# EAGLE board PCB-E21-CMB6_v03-17 (EAGLE 7.7.0), part 1 of 2
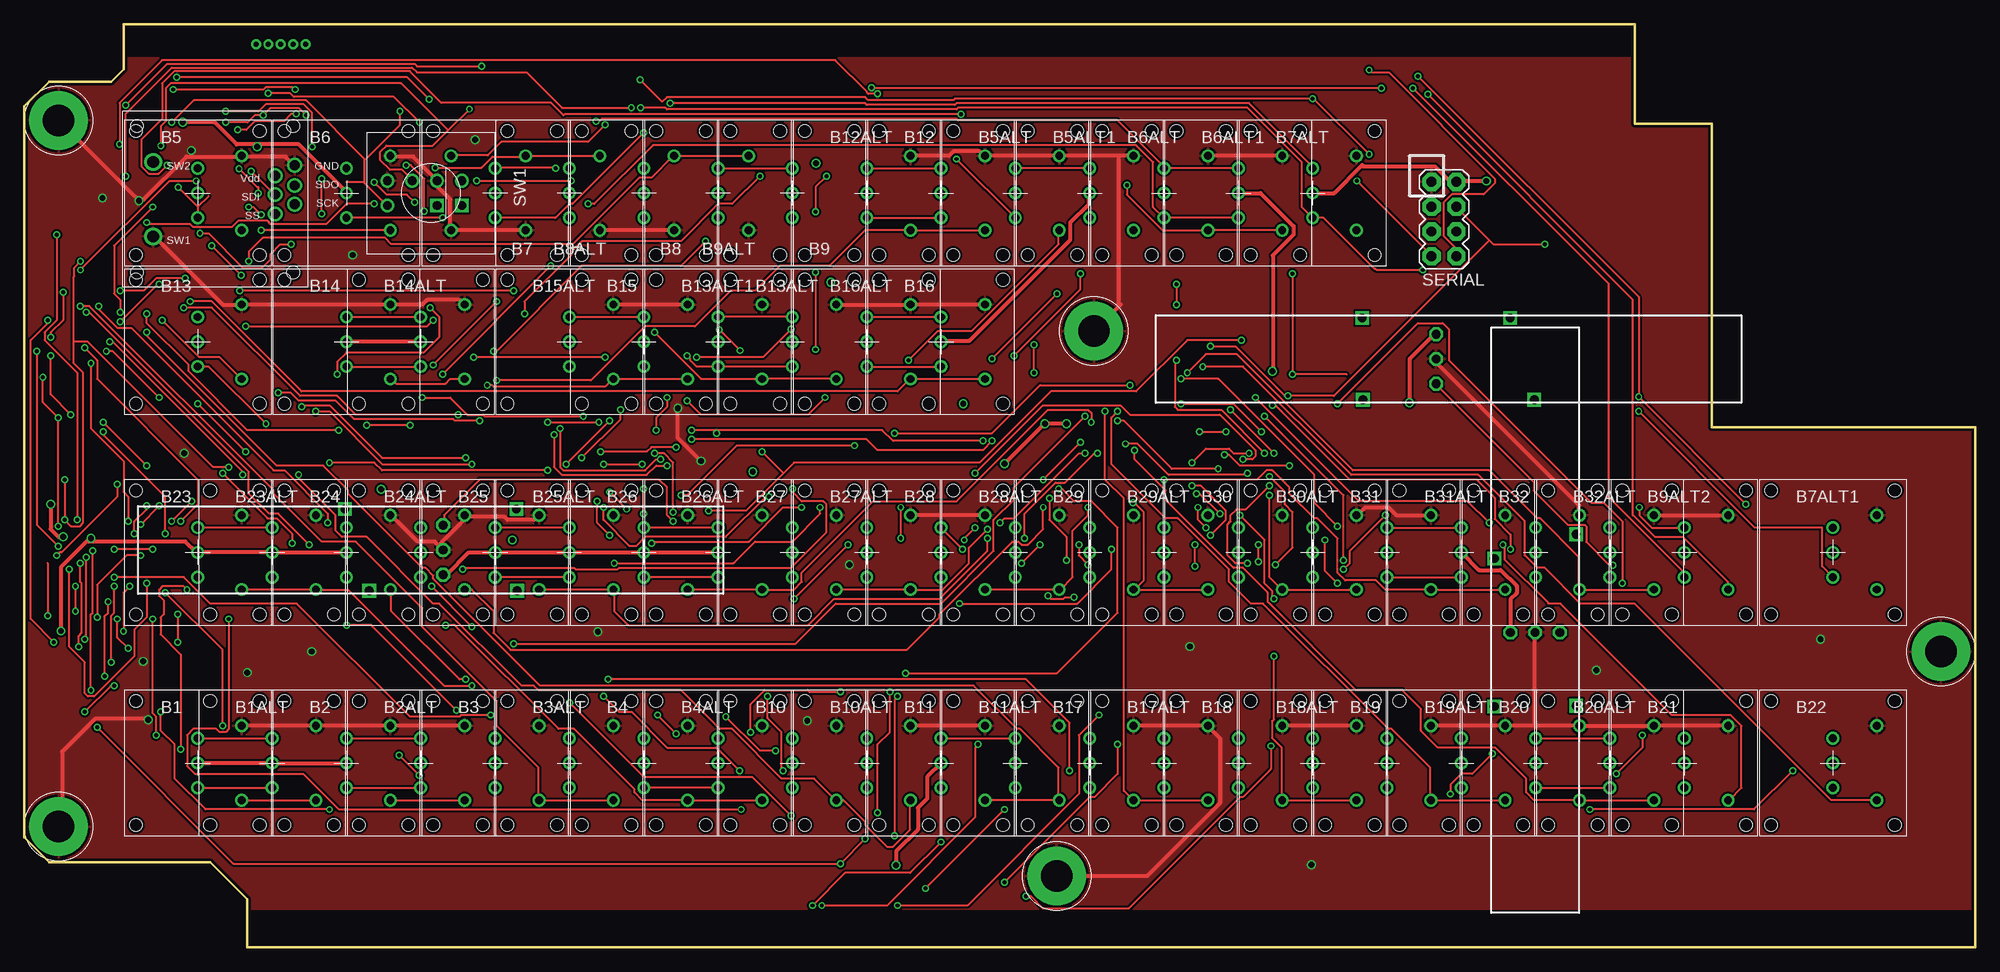
[diagram p6: board, top side]
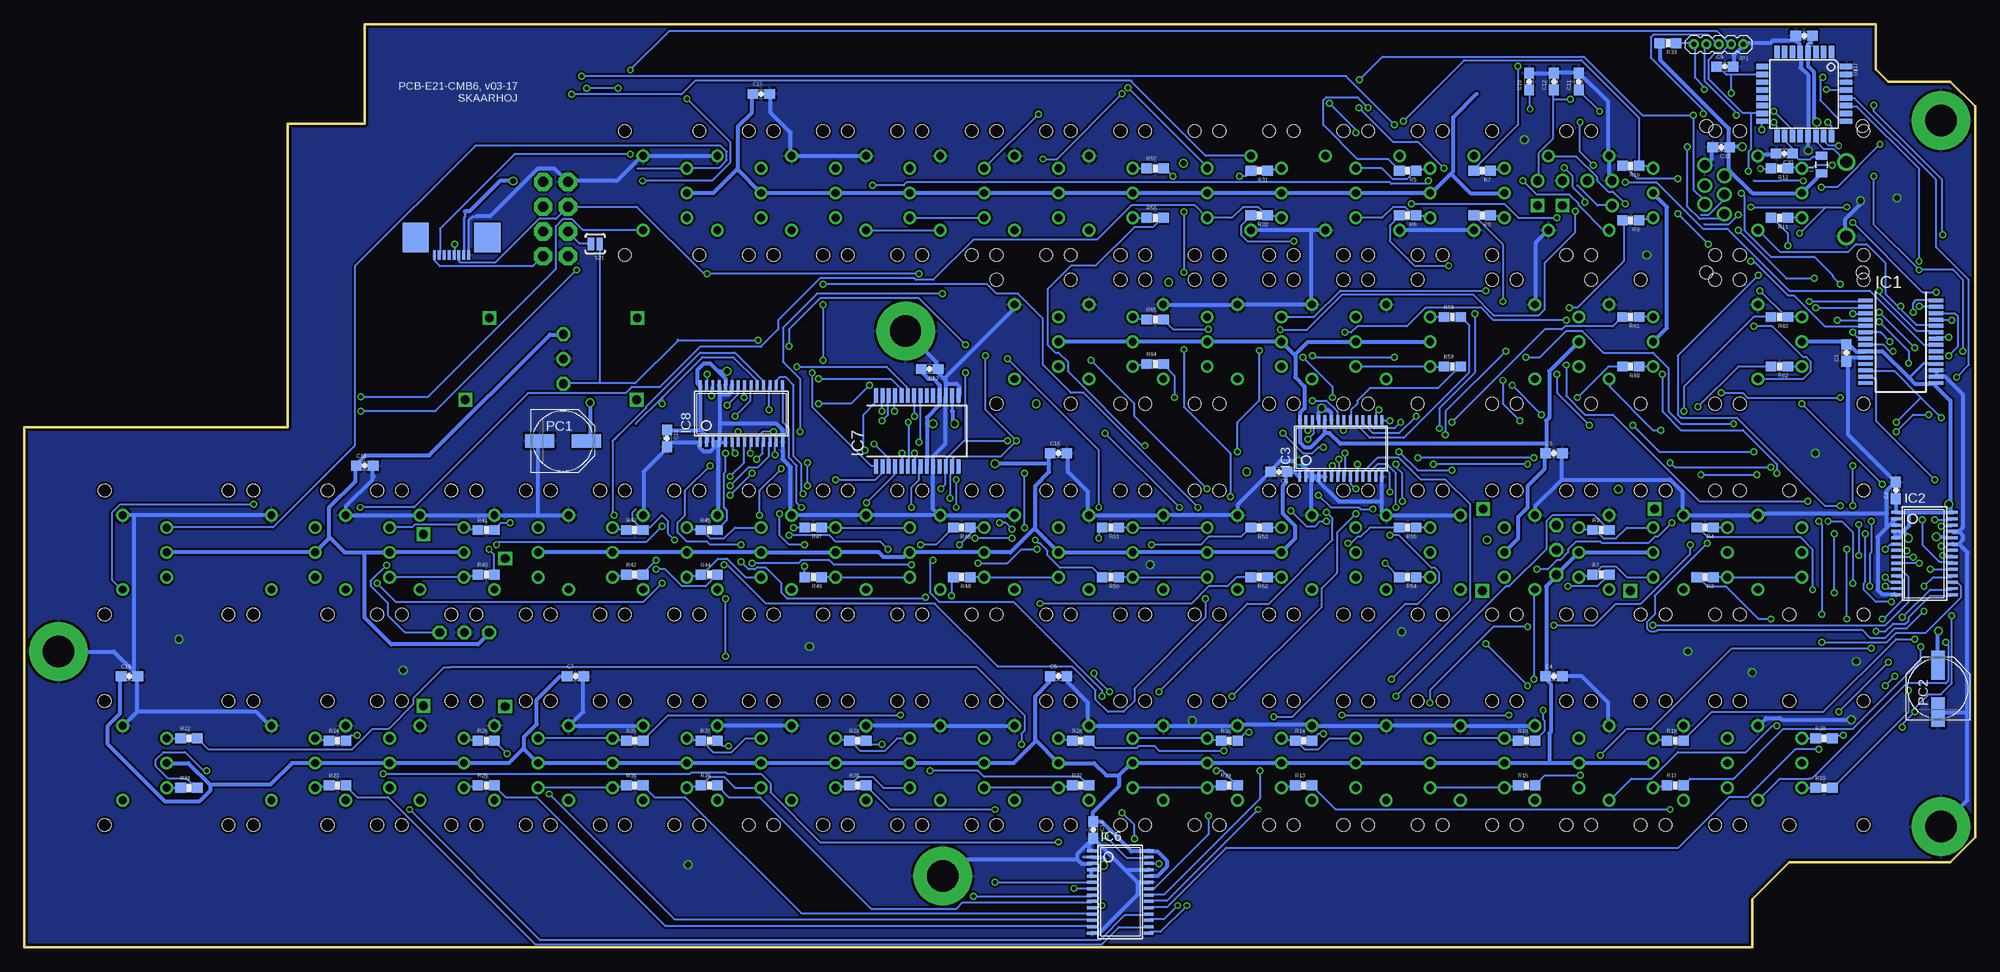
[diagram p7: board, bottom side, seen from below]

Size 200 x 94.6 mm. Coordinates in mm from the lower left corner, seen from the top.
Outline: 0,86.2 0,11.27 2.54,8.73 19.05,8.73 22.86,4.92 22.86,0 200,0 200,53.3 173.03,53.3 173.03,84.42 165.1,84.42 165.1,94.6 10.16,94.6 10.16,90.01 8.89,88.74 2.54,88.74 0,86.2
Copper layers (1*16): Top 0.035mm / dielectric 1.5mm / Bottom 0.035mm
Design rules "Fusion_eagle_rule_v1.1": minimum track width 6mil, minimum drill 12mil, track to track 6mil, track to pad 6mil, pad to pad 6mil, via to via 6mil, smd to smd 0mil, copper to edge 10mil, drill to drill 10mil, minimum pad ring 10mil, minimum via ring 6mil, stop-mask expansion 2mil, vias tented up to drill 100mil, thermal gap 10mil
Net classes: 0 default: width 0.203 mm, drill 0.406 mm, clearance 0.152 mm; 1 Power: width 0.406 mm, drill 0.61 mm, clearance 0.203 mm
tRestrict: area 0,-2.7 to 223,3.8; area 0,91.3 to 223,97.3
bRestrict: area 0,94.8 to 223,97.3; area 0,-2.7 to 223,-0.2

## Footprints (pad centres in the part's own frame; a part is rotated, then mirrored left to right if it is on the bottom)
LP11 = drill 0.8: COM 0,0; P$2 0,2.54; P$3 0,-2.54; P$4 4.5,3.81; P$5 4.5,-3.81 | hole 1.3: -6.35,6.35; 6.35,6.35; 6.35,-6.35; -6.35,-6.35
0603-CAP = smd 1.1 x 1: 1 -0.85,0; 2 0.85,0
SSOP28 = smd 0.4 x 1.5: 1 -4.225,-3.625; 2 -3.575,-3.625; 3 -2.925,-3.625; 4 -2.275,-3.625; 5 -1.625,-3.625; 6 -0.975,-3.625; 7 -0.325,-3.625; 8 0.325,-3.625; 9 0.975,-3.625; 10 1.625,-3.625; 11 2.275,-3.625; 12 2.925,-3.625; 13 3.575,-3.625; 14 4.225,-3.625; 15 4.225,3.625; 16 3.575,3.625; 17 2.925,3.625; 18 2.275,3.625; 19 1.625,3.625; 20 0.975,3.625; 21 0.325,3.625; 22 -0.325,3.625; 23 -0.975,3.625; 24 -1.625,3.625; 25 -2.275,3.625; 26 -2.925,3.625; 27 -3.575,3.625; 28 -4.225,3.625
TSSOP28 = smd 0.305 x 0.991: 1 -4.225,-2.918; 2 -3.575,-2.918; 3 -2.925,-2.918; 4 -2.275,-2.918; 5 -1.625,-2.918; 6 -0.975,-2.918; 7 -0.325,-2.918; 8 0.325,-2.918; 9 0.975,-2.918; 10 1.625,-2.918; 11 2.275,-2.918; 12 2.925,-2.918; 13 3.575,-2.918; 14 4.225,-2.918; 15 4.225,2.918; 16 3.575,2.918; 17 2.925,2.918; 18 2.275,2.918; 19 1.625,2.918; 20 0.975,2.918; 21 0.325,2.918; 22 -0.325,2.918; 23 -0.975,2.918; 24 -1.625,2.918; 25 -2.275,2.918; 26 -2.925,2.918; 27 -3.575,2.918; 28 -4.225,2.918
1X05-1.27MM = drill 0.508 pad 1: 1 0,0; 2 1.27,0; 3 2.54,0; 4 3.81,0; 5 5.08,0
0805 = smd 0.8 x 1.2: 1 -0.9,0; 2 0.9,0
PANASONIC_D = smd 3 x 1.4: + 2.4,0; - -2.4,0
SLIDER45-CAR1 = drill 0.9 octagon: 1 -1.27,2.54; 2A -1.27,-2.54; 3 -1.27,0 | drill 0.9 square: P$1 -8.852,4.191; P$2 6.312,4.191; P$3 8.788,-4.191; P$4 -8.788,-4.191
0603-RES = smd 1.1 x 1: 1 -0.85,0; 2 0.85,0
2X4 = drill 1.016 pad 1.88 octagon: 1 -3.81,-1.27; 2 -3.81,1.27; 3 -1.27,-1.27; 4 -1.27,1.27; 5 1.27,-1.27; 6 1.27,1.27; 7 3.81,-1.27; 8 3.81,1.27
SJ_2S-NO = smd 0.635 x 1.27: 1 -0.45,0; 2 0.45,0
SMART_SWITCH = drill 1.2: 1 6.35,3.81; 2 6.35,-3.81 | drill 1: 3 -8.153,-3.48; 4 -6.147,-2.413; 5 -8.153,-1.422; 6 -6.147,-0.483; 7 -8.153,0.508; 8 -6.147,1.499 | hole 1.3: -8.001,7.506; 8.001,7.506; 8.001,-7.506; -8.001,-7.506
ALPS_EC12E_SW-CAR1 = drill 0.9: A 1.27,-4.445; B -1.27,-1.905; C -1.27,-4.445; D -1.27,0.635; E -1.27,3.175 | drill 0.9 square: GND1 1.27,3.175; GND2 1.27,0.635
TQFP32-08 = smd 1.27 x 0.559: 1 -4.293,2.8; 2 -4.293,2; 3 -4.293,1.2; 4 -4.293,0.4; 5 -4.293,-0.4; 6 -4.293,-1.2; 7 -4.293,-2; 8 -4.293,-2.8; 17 4.293,-2.8; 18 4.293,-2; 19 4.293,-1.2; 20 4.293,-0.4; 21 4.293,0.4; 22 4.293,1.2; 23 4.293,2; 24 4.293,2.8 | smd 0.559 x 1.27: 9 -2.8,-4.293; 10 -2,-4.293; 11 -1.2,-4.293; 12 -0.4,-4.293; 13 0.4,-4.293; 14 1.2,-4.293; 15 2,-4.293; 16 2.8,-4.293; 25 2.8,4.293; 26 2,4.293; 27 1.2,4.293; 28 0.4,4.293; 29 -0.4,4.293; 30 -1.2,4.293; 31 -2,4.293; 32 -2.8,4.293
3.2MMPAD6MM = drill 3.2 pad 6: P$1 0,0
ZIP-8-0.5 = smd 2.7 x 3: GND$1 3.68,-1.8; GND$9 -3.68,-1.8 | smd 0.3 x 0.96: P$1 -1.75,0; P$2 -1.25,0; P$3 -0.75,0; P$4 -0.25,0; P$5 0.25,0; P$6 0.75,0; P$7 1.25,0; P$8 1.75,0

## Placement (x,y rotation side)
B1  LP11-B"  [LP11]  17.78,18.89 0 top
B1ALT  LP11-B"  [LP11]  25.4,18.89 0 top
B2  LP11-B"  [LP11]  33.02,18.89 0 top
B2ALT  LP11-B"  [LP11]  40.64,18.89 0 top
B3  LP11-B"  [LP11]  48.26,18.89 0 top
B3ALT  LP11-B"  [LP11]  55.88,18.89 0 top
B4  LP11-B"  [LP11]  63.5,18.89 0 top
B4ALT  LP11-B"  [LP11]  71.12,18.89 0 top
B5  LP11-B"  [LP11]  17.78,77.31 0 top
B5ALT  LP11-B"  [LP11]  101.6,77.31 0 top
B5ALT1  LP11-B"  [LP11]  109.22,77.31 0 top
B6  LP11-B"  [LP11]  33.02,77.31 0 top
B6ALT  LP11-B"  [LP11]  116.84,77.31 0 top
B6ALT1  LP11-B"  [LP11]  124.46,77.31 0 top
B7  LP11-B"  [LP11]  48.26,77.31 180 top
B7ALT  LP11-B"  [LP11]  132.08,77.31 0 top
B7ALT1  LP11-B"  [LP11]  185.42,40.48 0 top
B8  LP11-B"  [LP11]  63.5,77.31 180 top
B8ALT  LP11-B"  [LP11]  55.88,77.31 180 top
B9  LP11-B"  [LP11]  78.74,77.31 180 top
B9ALT  LP11-B"  [LP11]  71.12,77.31 180 top
B9ALT2  LP11-B"  [LP11]  170.18,40.48 0 top
B10  LP11-B"  [LP11]  78.74,18.89 0 top
B10ALT  LP11-B"  [LP11]  86.36,18.89 0 top
B11  LP11-B"  [LP11]  93.98,18.89 0 top
B11ALT  LP11-B"  [LP11]  101.6,18.89 0 top
B12  LP11-B"  [LP11]  93.98,77.31 0 top
B12ALT  LP11-B"  [LP11]  86.36,77.31 0 top
B13  LP11-B"  [LP11]  17.78,62.07 0 top
B13ALT  LP11-B"  [LP11]  78.74,62.07 0 top
B13ALT1  LP11-B"  [LP11]  71.12,62.07 0 top
B14  LP11-B"  [LP11]  33.02,62.07 0 top
B14ALT  LP11-B"  [LP11]  40.64,62.07 0 top
B15  LP11-B"  [LP11]  63.5,62.07 0 top
B15ALT  LP11-B"  [LP11]  55.88,62.07 0 top
B16  LP11-B"  [LP11]  93.98,62.07 0 top
B16ALT  LP11-B"  [LP11]  86.36,62.07 0 top
B17  LP11-B"  [LP11]  109.22,18.89 0 top
B17ALT  LP11-B"  [LP11]  116.84,18.89 0 top
B18  LP11-B"  [LP11]  124.46,18.89 0 top
B18ALT  LP11-B"  [LP11]  132.08,18.89 0 top
B19  LP11-B"  [LP11]  139.7,18.89 0 top
B19ALT  LP11-B"  [LP11]  147.32,18.89 0 top
B20  LP11-B"  [LP11]  154.94,18.89 0 top
B20ALT  LP11-B"  [LP11]  162.56,18.89 0 top
B21  LP11-B"  [LP11]  170.18,18.89 0 top
B22  LP11-B"  [LP11]  185.42,18.89 0 top
B23  LP11-B"  [LP11]  17.78,40.48 0 top
B23ALT  LP11-B"  [LP11]  25.4,40.48 0 top
B24  LP11-B"  [LP11]  33.02,40.48 0 top
B24ALT  LP11-B"  [LP11]  40.64,40.48 0 top
B25  LP11-B"  [LP11]  48.26,40.48 0 top
B25ALT  LP11-B"  [LP11]  55.88,40.48 0 top
B26  LP11-B"  [LP11]  63.5,40.48 0 top
B26ALT  LP11-B"  [LP11]  71.12,40.48 0 top
B27  LP11-B"  [LP11]  78.74,40.48 0 top
B27ALT  LP11-B"  [LP11]  86.36,40.48 0 top
B28  LP11-B"  [LP11]  93.98,40.48 0 top
B28ALT  LP11-B"  [LP11]  101.6,40.48 0 top
B29  LP11-B"  [LP11]  109.22,40.48 0 top
B29ALT  LP11-B"  [LP11]  116.84,40.48 0 top
B30  LP11-B"  [LP11]  124.46,40.48 0 top
B30ALT  LP11-B"  [LP11]  132.08,40.48 0 top
B31  LP11-B"  [LP11]  139.7,40.48 0 top
B31ALT  LP11-B"  [LP11]  147.32,40.48 0 top
B32  LP11-B"  [LP11]  154.94,40.48 0 top
B32ALT  LP11-B"  [LP11]  162.56,40.48 0 top
C1  100nF  [0603-CAP]  13.21,60.93 90 bottom
C2  100nF  [0603-CAP]  8.13,46.83 90 bottom
C3  100nF  [0603-CAP]  17.53,93.44 180 bottom
C4  100nF  [0603-CAP]  43.18,27.78 0 bottom
C5  100nF  [0603-CAP]  93.98,27.78 0 bottom
C6  100nF  [0603-CAP]  43.18,50.64 0 bottom
C7  100nF  [0603-CAP]  143.51,27.78 0 bottom
C8  100nF  [0603-CAP]  71.37,48.73 180 bottom
C9  10nF  [0603-CAP]  25.65,90.26 0 bottom
C10  10nF  [0603-CAP]  45.72,88.74 90 bottom
C11  10nF  [0603-CAP]  40.64,88.74 90 bottom
C12  10nF  [0603-CAP]  43.18,88.74 90 bottom
C13  100nF  [0603-CAP]  107.19,59.28 180 bottom
C14  100nF  [0603-CAP]  90.42,12.03 270 bottom
C15  100nF  [0603-CAP]  134.11,52.16 270 bottom
C16  100nF  [0603-CAP]  93.98,50.64 0 bottom
C17  100nF  [0603-CAP]  124.46,87.47 0 bottom
C18  100nF  [0603-CAP]  165.1,49.37 0 bottom
C19  100nF  [0603-CAP]  189.23,27.78 0 bottom
C20  100nF  [0603-CAP]  19.56,81.37 180 bottom
C22  100nF  [0603-CAP]  26.04,82.01 180 bottom
IC1  MCP23017SS  [SSOP28]  7.62,62.07 270 bottom
IC2  PCA9685  [TSSOP28]  5.21,40.35 270 bottom
IC3  PCA9685  [TSSOP28]  65.02,51.15 0 bottom
IC6  PCA9685  [TSSOP28]  87.63,5.68 270 bottom
IC7  MCP23017SS  [SSOP28]  108.46,52.93 0 bottom
IC8  PCA9685  [TSSOP28]  126.49,54.7 0 bottom
JP1  [1X05-1.27MM]  23.75,92.55 180 bottom
L1  [0805]  15.75,80.23 90 bottom
PC1  47u  [PANASONIC_D]  144.78,51.91 0 bottom
PC2  47u  [PANASONIC_D]  3.81,26.51 90 bottom
POT1  SLIDERC45  [SLIDER45-CAR1]  41.66,40.73 180 top
POT1ALT  SLIDERC45  [SLIDER45-CAR1]  146.01,60.31 0 top
POT2  SLIDERC45  [SLIDER45-CAR1]  154.89,33.54 90 top
R1  560R  [0603-RES]  38.35,38.19 0 bottom
R2  560R  [0603-RES]  38.35,42.77 0 bottom
R3  560R  [0603-RES]  27.69,37.94 180 bottom
R4  560R  [0603-RES]  27.69,43.02 180 bottom
R5  560R  [0603-RES]  58.17,79.6 180 bottom
R6  560R  [0603-RES]  58.17,75.02 180 bottom
R7  560R  [0603-RES]  50.55,79.6 180 bottom
R8  560R  [0603-RES]  50.55,75.02 180 bottom
R9  560R  [0603-RES]  35.31,74.52 180 bottom
R10  560R  [0603-RES]  35.31,80.1 180 bottom
R11  560R  [0603-RES]  20.07,74.77 180 bottom
R12  560R  [0603-RES]  20.07,79.85 180 bottom
R13  560R  [0603-RES]  68.83,16.6 0 bottom
R14  560R  [0603-RES]  68.83,21.18 0 bottom
R15  560R  [0603-RES]  45.97,16.6 0 bottom
R16  560R  [0603-RES]  45.97,21.18 0 bottom
R17  560R  [0603-RES]  30.73,16.6 0 bottom
R18  560R  [0603-RES]  30.73,21.18 0 bottom
R19  560R  [0603-RES]  15.49,16.35 0 bottom
R20  560R  [0603-RES]  15.49,21.43 0 bottom
R21  560R  [0603-RES]  183.13,16.35 0 bottom
R22  560R  [0603-RES]  183.13,21.43 0 bottom
R23  560R  [0603-RES]  167.89,16.6 0 bottom
R24  560R  [0603-RES]  167.89,21.18 0 bottom
R25  560R  [0603-RES]  152.65,16.6 0 bottom
R26  560R  [0603-RES]  152.65,21.18 0 bottom
R27  560R  [0603-RES]  91.69,16.6 0 bottom
R28  560R  [0603-RES]  91.69,21.18 0 bottom
R29  560R  [0603-RES]  76.45,16.6 0 bottom
R30  560R  [0603-RES]  76.45,21.18 0 bottom
R31  560R  [0603-RES]  73.41,79.6 180 bottom
R32  560R  [0603-RES]  73.41,75.02 180 bottom
R33  10K  [0603-RES]  31.5,92.68 180 bottom
R34  560R  [0603-RES]  137.41,16.6 0 bottom
R35  560R  [0603-RES]  137.41,21.18 0 bottom
R36  560R  [0603-RES]  129.79,16.6 0 bottom
R37  560R  [0603-RES]  129.79,21.18 0 bottom
R38  560R  [0603-RES]  114.55,16.6 0 bottom
R39  560R  [0603-RES]  114.55,21.18 0 bottom
R40  560R  [0603-RES]  152.65,38.19 0 bottom
R41  560R  [0603-RES]  152.65,42.77 0 bottom
R42  560R  [0603-RES]  137.41,38.19 0 bottom
R43  560R  [0603-RES]  137.41,42.77 0 bottom
R44  560R  [0603-RES]  129.79,38.19 0 bottom
R45  560R  [0603-RES]  129.79,42.77 0 bottom
R46  560R  [0603-RES]  119.13,37.94 180 bottom
R47  560R  [0603-RES]  119.13,43.02 180 bottom
R48  560R  [0603-RES]  103.89,37.94 180 bottom
R49  560R  [0603-RES]  103.89,43.02 180 bottom
R50  560R  [0603-RES]  88.65,37.94 180 bottom
R51  560R  [0603-RES]  88.65,43.02 180 bottom
R52  560R  [0603-RES]  73.41,37.94 180 bottom
R53  560R  [0603-RES]  73.41,43.02 180 bottom
R54  560R  [0603-RES]  58.17,37.94 180 bottom
R55  560R  [0603-RES]  58.17,43.02 180 bottom
R56  560R  [0603-RES]  84.07,74.77 0 bottom
R57  560R  [0603-RES]  84.07,79.85 0 bottom
R58  560R  [0603-RES]  53.59,59.53 0 bottom
R59  560R  [0603-RES]  53.59,64.61 0 bottom
R60  560R  [0603-RES]  35.31,59.53 180 bottom
R61  560R  [0603-RES]  35.31,64.61 180 bottom
R62  560R  [0603-RES]  20.07,59.53 180 bottom
R63  560R  [0603-RES]  20.07,64.61 180 bottom
R64  560R  [0603-RES]  84.07,59.78 0 bottom
R65  560R  [0603-RES]  84.07,64.36 0 bottom
SERIAL  M04X2  [2X4]  145.54,74.64 270 top
SJ1  SOLDERJUMPERNO  [SJ_2S-NO]  141.48,72.1 180 bottom
SSW1  SMART_SWITCHSMART_SWITCH_8PIN  [SMART_SWITCH]  19.56,76.67 180 top
SW1  EC12E_SWCAR1  [ALPS_EC12E_SW-CAR1]  41.67,77.31 270 top
U$17  ATTINY4832A  [TQFP32-08]  17.53,87.47 270 bottom
U$25  GNDPAD6MM  [3.2MMPAD6MM]  3.5,84.76 0 top
U$26  GNDPAD6MM  [3.2MMPAD6MM]  105.84,7.3 0 top
U$27  GNDPAD6MM  [3.2MMPAD6MM]  109.65,63.17 0 top
U$28  GNDPAD6MM  [3.2MMPAD6MM]  3.5,12.38 0 top
U$51  GNDPAD6MM  [3.2MMPAD6MM]  196.5,30.32 0 top
U$94  M04X2ZIF-0.5  [ZIP-8-0.5]  156.21,70.96 180 bottom

## Tracks (layer width: path | path; a pad name or v marks a point on that pad's centre or on a via)
5V  (via drill 0.61)
  Top 0.406: B1.COM B1ALT.COM B2.COM | v89.38,8.41 89.38,9.84 91.6,12.06 91.6,14.29 92.55,15.24 92.55,17.46 B11.COM | 137.15,80.15 134.3,77.31 B7ALT.COM | 137.15,80.15 137.16,80.17 | B24.COM B23ALT.COM B23.COM 17.62,40.48 16.51,41.59 6.83,41.59 | 6.83,41.59 6.35,41.59 3.81,39.05 3.75,38.92 v3.75,32.42 | v6.83,41.91 6.83,41.59 | B14ALT.COM B14.COM | POT1.1 43.02,38.26 43.34,38.26 45.56,40.48 B25.COM B25ALT.COM B26.COM B26ALT.COM | v106.84,53.66 v104.62,53.66 104.5,53.55 v100.5,49.55 | v3.97,42.07 3.49,42.07 2.7,42.86 v2.7,45.4 | v149.88,78.55 146.88,78.55 SERIAL.2 146.62,78.42 146.25,78.42 144.62,80.05 137.25,80.05 137.15,80.15 | v127.95,59.05 128,59.17 128,70.92 130.12,73.05 130.12,73.92 126.75,77.3 124.5,77.3 B6ALT1.COM | 162.5,40.55 B32ALT.COM | B5ALT1.COM 109.12,77.3 109.12,76.17 107.25,74.3 107.25,72.55 96.88,62.17 94,62.17 B16.COM | v142,55.8 142,60.3 144.5,62.8 POT1ALT.1 | v16.25,84.55 19.5,84.55 21.75,82.3 23.88,82.3 | 23.88,82.3 28.12,82.3 33,77.42 B6.COM | B31ALT.COM 149.12,38.67 151.38,38.67 153,37.05 153,36.3 152.38,35.67 152.38,32.3 POT2.1 | v23.88,82.05 23.88,82.3
  Bottom 0.254: U$94.P$2 154.94,70.98 154.94,74.77 154.81,74.9 154.81,75.41
  Bottom 0.305: IC7.16 104.9,56.55 104.9,54.96 | IC6.2 91.44,9.26 91.44,9.24 | IC1.18 5.32,59.79 6.76,58.35 | IC2.24 3.02,41.98 3.05,42
  Bottom 0.406: C13.2 108.04,58.98 107.31,58.26 106.81,58.26 106.17,57.62 106.17,56.56 IC7.18 106.2,56.35 106.2,55.56 107.47,54.29 107.47,53.66 | IC6.24 84.61,7.3 83.82,7.3 82.87,8.25 82.87,8.89 83.82,9.84 84.61,9.84 IC6.28 84.77,9.84 86.52,9.84 89.53,12.86 90.33,12.86 C14.1 90.49,13.02 90.49,13.81 87.79,16.51 87.79,17.62 | B2.COM B2ALT.COM 43.66,18.89 | 43.66,18.89 B3.COM B3ALT.COM B4.COM B4ALT.COM B10.COM B10ALT.COM 86.52,18.89 87.79,17.62 | 180.97,16.67 180.97,16.03 182.09,14.92 185.58,14.92 191.45,20.8 191.45,22.7 190.18,23.97 190.18,27.78 C19.1 | 180.97,16.67 183.2,18.89 B22.COM | C7.1 145.1,27.78 147.48,25.4 147.48,22.86 148.75,21.59 148.75,20.32 | 148.75,20.32 B19ALT.COM B19.COM B18ALT.COM B18.COM B17ALT.COM B17.COM B11ALT.COM 98.58,18.89 96.36,21.11 96.36,21.27 | 148.75,20.32 148.91,20.32 150.34,18.89 B20.COM B20ALT.COM B21.COM 172.56,18.89 174.78,16.67 180.97,16.67 | IC6.5 90.65,7.3 90.65,7.94 IC6.4 90.49,7.94 89.85,7.94 v89.38,8.41 89.38,8.57 89.22,8.73 89.22,9.05 89.38,9.21 90.49,9.21 IC6.2 | 96.36,21.27 96.36,25.72 94.93,27.14 94.93,27.78 C5.1 | 96.36,21.27 B11.COM 90.33,18.89 89.06,17.62 87.79,17.62 | 126.84,79.69 126.84,84.14 125.41,85.56 125.41,87.47 C17.1 | 126.84,79.69 B6ALT1.COM B6ALT.COM B5ALT1.COM B5ALT.COM B12.COM B12ALT.COM B9.COM B9ALT.COM B8.COM B8ALT.COM 55.72,77.31 53.74,79.29 | B7ALT.COM 129.38,77.31 127,79.69 126.84,79.69 | 51.12,87.47 53.5,85.09 53.5,79.53 53.74,79.29 | B7.COM 51.75,77.31 53.74,79.29 | 107.47,53.66 107.47,49.37 IC7.9 | 128.83,58.97 129.7,59.85 130.33,59.85 130.97,59.21 130.97,57.78 130.81,57.62 IC8.28 130.65,57.47 130.65,53.02
  Bottom 0.406: 128.83,58.97 128.11,58.26 IC8.24 | 130.65,53.02 130.02,52.39 130.02,51.91 IC8.2 | 130.65,53.02 133.99,53.02 C15.1 | v127.95,59.05 128.75,59.05 128.83,58.97 | B15ALT.COM B15.COM 68.42,62.07 69.69,60.8 69.69,60.64 | 66.67,52.7 66.67,53.97 IC3.24 | 66.67,52.7 68.1,51.27 68.74,51.27 69.22,51.75 69.22,53.97 IC3.28 69.22,54.13 69.22,54.77 68.74,55.24 68.74,57.47 69.69,58.42 69.69,60.64 | 69.69,60.64 B13ALT1.COM B13ALT.COM B16ALT.COM B16.COM | 168.75,41.91 168.75,45.08 166.05,47.78 166.05,49.37 C18.1 165.88,49.55 165,50.42 158.5,50.42 146.12,62.8 144.75,62.8 POT1ALT.1 | 168.75,41.91 B9ALT2.COM B7ALT1.COM | 165.12,40.48 167.16,40.48 168.59,41.91 168.75,41.91 | 165.12,40.48 B32ALT.COM B32.COM | B31ALT.COM B31.COM B30ALT.COM B30.COM B29ALT.COM 112.39,40.48 111.92,40 109.86,40 109.38,40.48 B29.COM B28ALT.COM 98.9,40.48 96.52,42.86 96.36,42.86 | IC2.4 8.26,42.54 8.26,42.07 IC2.5 7.94,42.07 7.38,42.62 | 8.1,44.61 6.83,44.61 | 6.83,44.61 2.54,44.61 | 2.54,44.61 2.38,44.61 IC2.28 | 8.1,44.61 IC2.1 | 8.1,44.61 8.1,45.88 C2.1 | 7.38,42.62 6.83,43.18 6.83,44.61 | 4.13,57.78 6.19,57.78 6.76,58.35 9.53,61.12 11.11,61.12 IC1.9 11.29,61.05 12.19,61.05 12.91,61.78 C1.2 13.02,61.91 13.18,62.07 B13.COM | 4.13,57.78 IC1.15 | 2.54,45.4 2.54,56.04 4.13,57.62 4.13,57.78 | 2.54,45.4 2.54,44.61 | 7.38,42.62 6.83,42.07 v6.83,41.91 | IC3.1 69.37,48.26 69.85,48.73 C8.1 70.64,48.58 70.64,47.62 70.96,47.31 70.96,44.45 69.69,43.18 69.69,41.91 B26ALT.COM B27.COM B27ALT.COM B28.COM 96.36,42.86 | 94.93,49.55 94.93,48.73 96.36,47.31 96.36,42.86 | 94.93,49.55 94.93,50.64 C16.1 | 43.97,51.59 43.97,53.97 43.66,54.29 43.66,59.05 B14ALT.COM
  Bottom 0.406: 43.97,51.59 43.97,50.64 C6.1 44.13,50.48 44.13,49.05 45.88,47.31 45.88,45.08 46.83,44.13 46.83,41.91 B25.COM | B6.COM 31.59,75.88 31.59,63.5 B14.COM | B24.COM B24ALT.COM POT1.1 42.86,38.1 43.97,36.99 43.97,27.78 C4.1 44.13,27.62 43.5,26.99 43.5,22.07 43.66,21.91 43.66,18.89 | 66.67,52.7 66.2,52.7 65.09,51.59 43.97,51.59 | v104.62,53.66 104.78,53.81 104.78,54.93 104.9,54.96 | 107.47,53.66 v106.84,53.66 | v3.97,42.07 3.17,42.07 3.05,42 | v2.7,45.4 2.54,45.4 | v149.88,78.55 151.25,78.55 154.38,75.42 154.75,75.42 154.81,75.41 | 94.93,49.55 v100.5,49.55 | v3.75,32.42 3.88,32.3 3.88,28.93 PC2.+ | v142,55.8 142,52.3 PC1.+ | L1.1 15.75,79.3 17.62,77.42 B5.COM 22.86,77.31 23,77.42 25.12,79.55 SSW1.4 25.62,79.17 25.25,79.55 25.25,81.92 C22.1 | R33.2 32.25,92.67 32.25,90.92 25.25,83.92 25.25,82.17 C22.1 | C3.1 16.75,93.42 16.75,92.92 17.12,92.55 17.12,91.8 U$17.4 17.12,91.67 17.12,90.3 16.5,89.67 16.5,84.8 v16.25,84.55 | 165.12,40.48 165.12,33.8 162.38,31.05 153.5,31.05 152.38,32.17 POT2.1 | v23.88,82.05 25,82.05 C22.1
A0  (via drill 0.41)
  Top 0.203: v66.52,43.65 65.88,44.29 65.88,47.15 65.09,47.94 46.67,47.94 43.02,44.29 43.02,43.34 POT1.2A | v70.17,44.77 73.98,44.77 77.82,48.61 | 77.82,48.61 78.9,49.69 97.95,49.69 105.25,56.99 113.98,56.99 119.22,62.23 v124.78,62.23 | v162.88,39.17 162.5,39.17 160.12,41.55 160.12,43.17 160,43.3 158.25,43.3 154.75,46.8 154.75,47.67 144.75,57.67 POT1ALT.2A | v25,87.55 27.25,87.55 27.62,87.17 37.88,87.17 v40.5,84.55 | v39.12,80.17 39.62,80.17 41,78.8 v41,75.42 | v73.38,61.17 v71.25,63.3 | 77.82,48.61 v75.62,50.8
  Bottom 0.203: v66.52,43.65 67.15,43.65 67.63,43.18 68.58,43.18 v70.17,44.77 | 133.03,62.23 133,62.23 | 133,62.23 v124.78,62.23 | 141,57.8 137.38,57.8 133,62.17 133,62.23 | 141,57.8 144.62,57.8 POT1ALT.2A | 133,62.3 133,62.23 | 25,89.42 21.88,89.42 U$17.10 | 25,89.42 25.5,89.42 26.25,90.17 26.5,90.17 C9.1 | 141,57.8 141,72.05 SJ1.1 | v162.88,39.17 164.5,37.55 164.5,37.05 162.75,35.3 162.75,34.05 161,32.3 157.5,32.3 POT2.2A | v25,87.55 25,89.42 | v40.5,84.55 40.5,81.55 v39.12,80.17 | v41,75.42 41,73.3 44.12,70.17 44.12,65.42 44.75,64.8 49.38,64.8 51.5,66.92 64.88,66.92 68.5,63.3 v71.25,63.3 | v73.38,61.17 73.38,56.05 75.62,53.8 v75.62,50.8
ENC1_A  (via drill 0.41)
  Top 0.203: 43.44,83.74 41.88,82.17 37.12,82.17 36.5,81.55 36.5,80.67 37.5,79.67 38.75,79.67 39.75,78.67 SW1.B | 43.44,83.74 v45.62,85.92 | v14,82.17 14,84.17 14.5,84.67 14.5,88.05 15,88.55 38.62,88.55 43.44,83.74
  Bottom 0.203: v45.62,85.92 45.62,87.8 C10.1 | v14,82.17 15,82.17 15.5,82.67 15.5,83.17 U$17.23
ENC1_B  (via drill 0.41)
  Top 0.203: 33.02,78.42 34.77,78.42 34.82,78.37 | 34.82,78.37 37.15,76.04 SW1.A | v38.5,85.67 38.5,84.3 34.94,80.74 | 34.94,80.74 34.88,80.67 34.88,78.42 34.82,78.37 | v15.12,84.55 17.38,86.8 28.88,86.8 34.94,80.74
  Bottom 0.203: 40.8,78.1 38.73,76.04 SW1.A | v38.5,85.67 40.62,87.8 C11.1 | v15.12,84.55 14.75,84.17 14.75,83.3 U$17.24
ENC1_BTN  (via drill 0.41)
  Top 0.203: v15.62,89.17 39.25,89.17 v41.5,86.92
  Bottom 0.203: 44.77,78.58 SW1.E 44.75,78.67 44.75,81.42 43.25,82.92 43.25,86.92 | 43.25,86.92 43.25,87.8 C12.1 | v15.62,89.17 15.88,88.92 15.88,86.8 13.75,84.67 13.25,84.67 U$17.25 | 43.25,86.92 v41.5,86.92
GND  (via drill 0.6, 0.61)
  Top 0.406: B16.P$4 B16ALT.P$4 B13ALT.P$4 | B15.P$4 B15ALT.P$4 | B9ALT.P$4 B8.P$4 | SSW1.1 13.34,72.86 20.32,65.88 B13.P$4 B14.P$4 40.8,65.88 41.27,66.36 44.61,66.36 45.09,65.88 B14ALT.P$4 | B8ALT.P$4 B7.P$4 43.66,73.66 43.66,76.67 42.39,77.94 42.39,78.58 SW1.D | 42.23,78.74 SW1.D | U$25.P$1 3.65,84.61 v11.75,76.52 11.88,76.67 12.25,76.67 16.62,81.05 17.12,81.05 | B24.P$4 37.62,44.29 40.32,41.59 42.07,41.59 POT1.3 42.55,41.27 45.09,43.81 45.09,44.29 B24ALT.P$4 45.24,44.13 49.21,44.13 49.53,43.81 52.23,43.81 52.7,44.29 B25.P$4 | v66.99,55.24 66.99,52.23 v69.37,49.85 | B12ALT.P$4 94.77,81.12 95.25,81.6 97.95,81.6 98.42,81.12 B12.P$4 B5ALT.P$4 112.24,81.12 | B5ALT1.P$4 112.24,81.12 | B6ALT1.P$4 B6ALT.P$4 | B32ALT.P$4 B9ALT2.P$4 | U$27.P$1 109.7,63.18 112.39,65.88 112.24,65.88 112.24,81.12 | B31.P$4 140.65,44.29 139.86,45.08 137.48,45.08 136.68,44.29 B30ALT.P$4 | B28.P$4 B27ALT.P$4 | B21.P$4 B20ALT.P$4 B20.P$4 154.88,22.7 | B18ALT.P$4 B18.P$4 | 154.88,22.7 B19ALT.P$4 B19.P$4 | 3.81,12.54 3.65,12.38 U$28.P$1 3.88,12.68 3.88,20.05 7.25,23.43 12.62,23.43 v12.7,23.34 | B1.P$4 B1ALT.P$4 B2.P$4 B2ALT.P$4 | B17.P$4 B17ALT.P$4 121.44,22.54 122.56,21.43 122.56,14.76 115.09,7.3 105.89,7.3 U$26.P$1 | B11.P$4 B10ALT.P$4 | POT1ALT.3 144.75,59.92 159.38,45.3 159.38,44.3 B32.P$4 | SSW1.3 27.62,80.17 26.75,81.05 22.38,81.05 B5.P$4 22.12,81.05 17.12,81.05 | 154.88,22.7 154.88,32.17 POT2.3 | 17.12,81.05 v17.12,81.67 | B6.P$4 37.62,81.05 39.88,81.05 42.12,78.8 SW1.D
  Bottom 0.254: U$94.P$1 154.43,70.99 154.43,74.52 154.05,74.9 153.67,74.9
  Bottom 0.406: IC1.10 12.84,60.45 C1.1 13.02,60.01 13.02,52.54 8.26,47.78 C2.2 8.26,47.62 9.05,46.83 9.05,44.45 | 105.7,58.29 106.34,58.93 C13.1 106.52,59.37 106.52,60.01 109.54,63.02 U$27.P$1 | 105.7,58.29 105.54,58.13 105.54,57.78 | 105.54,57.78 IC7.17 105.57,56.35 105.57,51.59 106.84,50.32 106.84,49.37 IC7.10 106.84,49.21 106.84,44.92 106.2,44.29 B28ALT.P$4 | B13ALT.P$4 B13ALT1.P$4 B15.P$4 68.1,65.88 68.1,73.5 | B9ALT.P$4 68.1,73.5 | 68.1,73.5 B9.P$4 | 4.29,85.41 3.65,84.77 U$25.P$1 | 37.31,78.58 SW1.C 37.5,78.55 37.5,81.05 B6.P$4 37.62,81.3 37.62,86.67 40.5,89.55 C11.2 40.75,89.67 43.12,89.67 C12.2 43.38,89.55 45.62,89.55 C10.2 | B14ALT.P$4 45.09,65.88 45.09,72.23 43.81,73.5 B7.P$4 | v11.75,76.52 11.75,76.2 13.34,74.61 13.34,72.86 SSW1.1 | B8ALT.P$4 B8.P$4 | 8.49,43.58 8.26,43.81 IC2.2 | 8.49,43.58 8.97,43.1 | 8.97,43.1 10,42.07 10,36.67 9.53,36.19 8.26,36.19 IC2.14 | 8.49,43.58 8.26,43.34 IC2.3 | 9.05,44.45 9.05,43.18 8.97,43.1 | 9.05,44.45 22.23,44.45 B23.P$4 B23ALT.P$4 30,44.45 30,46.67 31.27,47.94 42.39,47.94 | 42.39,47.94 42.39,50.64 C6.2 | 42.39,47.94 45.09,45.24 45.09,44.29 B24ALT.P$4 | C16.2 93.03,50.64 93.03,48.73 90.96,46.67 90.96,44.29 B27ALT.P$4 B27.P$4 B26ALT.P$4 75.56,44.29 75.56,45.4 C8.2 72.23,48.89 71.28,49.85 v69.37,49.85 67.94,48.42 IC3.3 | 60.8,45.72 60.8,44.61 60.48,44.29 B25ALT.P$4 B25.P$4 | 60.8,45.72 60.8,48.1 IC3.14 | 66.99,55.08 66.36,55.08 66.04,54.77 66.04,54.13 IC3.23 | 66.99,55.08 67.31,54.77 67.31,54.13 IC3.25 | IC3.5 66.67,48.26 67.15,48.26 IC3.4 67.47,48.26 67.63,48.26 | 67.63,48.26 67.94,48.26 | 67.94,48.26 IC3.3 | 67.94,48.26 68.58,48.26 IC3.2
  Bottom 0.406: v66.99,55.24 66.99,55.08 | B26.P$4 68.1,44.29 68.1,48.1 IC3.3 | 60.8,45.72 65.25,45.72 67.63,48.1 67.63,48.26 | C17.2 123.51,87.47 123.51,85.56 121.44,83.5 121.44,81.12 B6ALT.P$4 B5ALT1.P$4 | B6ALT1.P$4 B7ALT.P$4 136.68,81.12 139.22,78.58 139.38,78.55 144.12,78.55 SERIAL.1 144.38,78.55 145.62,79.8 147.38,79.8 152.25,74.92 153.62,74.92 153.67,74.9 | 147.32,44.29 B31ALT.P$4 B32.P$4 B32ALT.P$4 167,44.29 167,45.24 164.31,47.94 164.31,48.26 | 147.32,44.29 B31.P$4 | 164.31,48.26 164.31,49.37 C18.2 | B9ALT2.P$4 188.75,44.29 | 188.75,44.29 B7ALT1.P$4 | 164.15,48.26 164.31,48.26 | 105.54,57.78 104.46,57.78 104.14,57.47 104.14,56.67 IC7.15 | IC8.5 128.11,51.75 128.75,51.75 IC8.4 | IC8.3 129.38,51.75 128.91,51.75 IC8.4 | 128.67,56.91 128.75,56.99 128.75,57.47 IC8.25 | 128.67,56.91 128.43,56.67 127.79,56.67 127.48,56.99 127.48,57.47 IC8.23 | 128.75,53.66 128.75,56.83 128.67,56.91 | 128.75,53.66 128.75,51.91 IC8.4 | IC8.4 128.91,51.59 129.7,50.8 130.33,50.8 130.81,51.27 130.81,51.59 IC8.1 130.81,51.75 133.67,51.75 133.99,51.43 C15.2 133.99,51.27 136.53,48.73 136.53,44.29 B30ALT.P$4 | B30.P$4 128.91,44.29 128.91,51.43 IC8.4 | B28ALT.P$4 B28.P$4 | B28ALT.P$4 B29.P$4 B29ALT.P$4 121.44,44.29 121.44,49.21 122.24,50 122.24,51.75 IC8.14 122.24,51.91 122.24,53.02 122.87,53.66 128.75,53.66 | 105.7,58.29 98.58,65.4 98.58,65.88 B16.P$4 | 188.44,24.13 188.44,27.78 C19.2 188.44,27.94 188.83,28.34 | 188.44,24.13 189.87,22.7 B22.P$4 | 188.83,28.34 190.82,30.32 U$51.P$1 | C7.2 142.72,27.78 142.72,24.13 144.15,22.7 B19.P$4 B18ALT.P$4 | 188.44,24.13 176.21,24.13 174.78,22.7 B21.P$4 | 1.75,41.27 2.22,41.27 IC2.23
  Bottom 0.406: 1.75,41.27 1.27,41.75 1.27,42.23 1.59,42.54 | 1.59,42.54 2.22,42.54 IC2.25 | IC1.17 3.97,59.05 3.97,58.58 IC1.16 3.81,58.58 3.17,58.58 1.27,56.67 1.27,43.02 1.59,42.7 1.59,42.54 | 0.79,24.05 0.79,15.08 U$28.P$1 | 0.79,24.05 0.79,40.48 1.59,41.27 1.75,41.27 | C4.2 40.32,27.78 37.62,25.08 37.62,22.7 B2.P$4 | B2ALT.P$4 B3.P$4 B3ALT.P$4 B4.P$4 68.1,22.86 75.56,22.86 B4ALT.P$4 B10.P$4 B10ALT.P$4 90.96,22.7 90.96,25.08 93.03,27.14 93.03,27.78 C5.2 | 85.88,6.67 84.77,6.67 IC6.23 | 87.07,7.86 90.33,11.11 C14.2 | 87.07,7.86 85.88,6.67 | IC6.25 84.77,7.94 87,7.94 87.07,7.86 | 85.88,6.67 85.88,5.4 89.85,1.43 90.49,1.43 IC6.14 | C14.2 90.33,10.95 90.96,10.32 90.65,10 IC6.1 | 103.98,9.05 105.73,7.3 U$26.P$1 103.82,9.05 92.08,9.05 | B11.P$4 B11ALT.P$4 B17.P$4 | v12.7,23.34 19.84,23.34 20,23.49 21.43,23.49 22.23,22.7 B1.P$4 | 3.97,23.34 PC2.- 3.62,24.05 0.79,24.05 | B17ALT.P$4 B18.P$4 | 188.75,44.29 188.75,28.41 188.83,28.34 | 92.08,9.05 91.6,8.57 90.65,8.57 IC6.3 | 92.08,9.05 92.08,9.52 90.49,11.11 C14.2 | 147.32,44.29 147.32,51.91 PC1.- | C9.2 24.75,90.3 24.75,91.42 23.62,92.55 JP1.1 23.5,92.67 21,92.67 20.75,92.92 18.38,92.92 | 18.38,92.92 18.38,93.42 C3.2 | 18.38,92.92 18,92.55 18,91.8 U$17.5 17.88,91.67 17.88,90.17 17.12,89.42 17.12,83.3 U$17.21 17.12,83.05 v17.12,81.67 | C20.2 20.5,81.3 22.12,81.3 22.25,81.17 B5.P$4 | C22.2 27,81.92 27,80.8 27.62,80.17 SSW1.3
  other vias: 184.15,31.59 161.16,28.41 131.95,8.48 119.51,30.83 58.8,32.35 29.46,30.32 22.86,28.16 12.19,29.3 16.38,50.64 8,76.8 33.66,70.96 46.23,82.77 80.26,23.21 84.58,39.21
  pour Top: 0,-2.7 200.66,-2.7 200.66,97.63 0,97.63
  pour Bottom: 0,-2.7 200.66,-2.7 200.66,97.63 0,97.63
  pour Bottom: 0,-2.7 200.66,-2.7 200.66,97.63 0,97.63
GPA0  (via drill 0.41)
  Top 0.203: v35.88,78.42 37.15,77.15 39.21,77.15 v40.01,76.36 | B8.P$5 B8ALT.P$5 51.38,81.05 48,81.05 46.88,79.92 v42.12,79.92
  Bottom 0.203: v35.88,78.42 32.7,78.42 27.94,73.66 25.4,73.66 19.05,67.31 10.79,67.31 5.24,61.75 4.13,61.75 IC1.21 | v40.01,76.36 40.01,76.67 41.25,77.92 | 41.27,77.94 41.25,77.92 | v42.12,79.92 41.25,79.05 41.25,77.92
GPA1  (via drill 0.41)
  Top 0.203: v2.7,62.55 2.7,63.02 3.97,64.29 v3.97,67.15 | v12.54,74.29 12.7,74.13 16.99,74.13 17.3,73.82 21.27,73.82 21.91,74.45 24.92,74.45 25.24,74.13 30.96,74.13 33.02,76.2 v35.88,76.2 | v59.53,84.3 57.78,82.55 48.9,82.55 48.88,82.55 47.5,81.17 43.88,81.17 B7.P$5 | v176.5,45.42 v165.5,56.42 165.5,66.67 v142.88,89.3
  Bottom 0.203: v2.7,62.55 3.97,62.55 IC1.22 | v3.97,67.15 5.4,67.15 v12.54,74.29 | v35.88,76.2 37.15,77.47 37.62,77.47 38.73,78.58 38.75,78.67 38.75,78.92 40.88,81.05 43.75,81.05 B7.P$5 | B7ALT1.P$5 190.02,36.67 190.98,37.62 190.98,44.61 190.18,45.4 176.53,45.4 v176.5,45.42 | v59.53,84.3 64.45,89.22 64.5,89.3 v142.88,89.3 | v165.5,56.42 158.62,56.42 145.5,69.55 145.5,73.92 144.75,74.67 143.88,74.67 142.75,73.55 136.62,73.55 B7ALT.P$5
GPA2  (via drill 0.41)
  Top 0.203: B6ALT1.P$5 B6ALT.P$5 116.68,73.5 113.03,77.15 v113.03,78.1 | v9.84,67.31 12.22,67.31 13.49,68.58 v16.51,68.58 | B6.P$5 v24.29,73.5 | v46.35,78.58 v56.04,78.58
  Bottom 0.203: v9.84,67.31 9.84,66.99 6.03,63.18 4.13,63.18 IC1.23 | v16.51,68.58 19.37,68.58 v24.29,73.5 | v113.03,78.1 109.86,78.1 109.54,78.42 60.01,78.42 59.85,78.26 56.36,78.26 v56.04,78.58 | v46.35,78.58 44.93,77.15 41.59,77.15 40.64,76.2 40.64,76.04 38.1,73.5 B6.P$5
GPA3  (via drill 0.41)
  Top 0.203: v90.65,60.16 93.66,63.18 97.16,63.18 106.05,72.07 106.05,73.5 B5ALT.P$5 | v78.74,46.99 78.74,46.67 79.69,45.72 81.92,45.72 82.23,45.4 82.23,42.54 78.58,38.89 60.96,38.89 60.8,38.73 56.52,38.73 56.36,38.89 45.09,38.89 v44.93,38.73 | v31.11,43.5 31.11,44.45 26.67,48.89 25.56,48.89 10.95,63.5 9.53,63.5 7.62,65.4 v7.62,65.72
  Bottom 0.203: B5ALT1.P$5 B5ALT.P$5 | 7.78,65.56 9.21,66.99 9.21,70.17 11.11,72.07 12.22,72.07 13.02,71.28 20,71.28 22.23,73.5 B5.P$5 | 7.78,65.56 6.03,63.82 4.13,63.82 IC1.24 | v90.65,60.16 86.2,55.72 86.2,54.45 v78.74,46.99 | v44.93,38.73 43.81,38.73 42.86,39.69 42.55,39.69 41.75,40.48 41.75,40.8 40.96,41.59 38.42,41.59 38.26,41.43 33.5,41.43 32.86,42.07 32.54,42.07 v31.11,43.5 | 7.78,65.56 v7.62,65.72
GPA4  (via drill 0.41)
  Top 0.203: v2.38,64.29 2.38,63.97 0.64,62.23 0.64,33.65 v3.02,31.27 | B1.P$5 B1ALT.P$5
  Bottom 0.203: v2.38,64.29 3.97,64.29 IC1.25 | 17,17.3 20,17.3 22.23,15.08 B1.P$5 | 17,17.3 16.99,17.3 | 17,17.3 16.75,17.3 7,27.05 3,27.05 2.75,27.3 2.75,30.93 3,31.18 v3.02,31.27
GPA4S
  Bottom 0.203: U$17.22 16.25,83.17 16.25,82.55 15.5,81.8 14.5,81.8 13.25,80.55 SSW1.2
GPA5  (via drill 0.41)
  Top 0.203: v2.7,60.64 2.7,56.67 v4.76,54.61 | v8.1,52.86 8.1,52.54 14.45,46.2 v14.45,42.38 | v14.45,36.35 20.32,30.48 v20.32,22.7 | B2.P$5 B2ALT.P$5
  Bottom 0.203: v2.7,60.64 1.75,61.59 1.75,64.61 2.06,64.93 3.97,64.93 IC1.26 | v4.76,54.61 6.35,54.61 v8.1,52.86 | v14.45,36.35 v14.45,42.38 | v20.32,22.7 20.8,22.7 23.5,20 30.48,20 33.18,17.3 35.24,17.3 37.47,15.08 B2.P$5
GPA6  (via drill 0.41)
  Top 0.203: v5.71,65.72 6.67,65.72 25.56,46.83 25.56,46.51 30.48,41.59 33.97,41.59 40.8,34.77 40.8,32.86 48.42,25.24 48.42,22.7 52.7,18.41 52.7,15.08 B3.P$5 B3ALT.P$5
  Bottom 0.203: v5.71,65.72 4.13,65.72 IC1.27
GPA7  (via drill 0.41)
  Top 0.203: v6.35,65.09 6.67,65.09 23.02,48.73 23.02,46.51 25.08,44.45 26.04,44.45 v29.21,41.27 | v43.18,33.02 44.13,33.02 54.77,22.38 56.36,22.38 62.55,16.19 62.55,15.87 63.34,15.08 B4.P$5 B4ALT.P$5
  Bottom 0.203: v6.35,65.09 6.35,66.04 6.03,66.36 4.13,66.36 IC1.28 | v29.21,41.27 29.21,40.32 34.29,35.24 36.83,35.24 39.05,33.02 v43.18,33.02
GPA8  (via drill 0.41)
  Top 0.203: v16.99,66.2 19.21,66.2 28.42,56.99 89.53,56.99 90.81,58.26 B16ALT.P$5 B16.P$5
  Bottom 0.203: v16.99,66.2 11.27,66.2 IC1.1
GPA9  (via drill 0.41)
  Top 0.203: v16.35,65.56 19.21,65.56 28.26,56.51 32.07,56.51 33.97,54.61 v44.45,54.61 | v47.47,57.62 47.94,57.62 48.1,57.47 59.53,57.47 60.33,58.26 B15ALT.P$5 B15.P$5
  Bottom 0.203: v16.35,65.56 11.27,65.56 IC1.2 | v47.47,57.62 v44.45,54.61
GPA10  (via drill 0.41)
  Top 0.203: v12.54,64.93 12.54,63.97 16.83,59.69 16.83,59.05 22.86,53.02 v32.23,53.02 | B14ALT.P$5 43.66,58.26 43.18,57.78 38.1,57.78 37.62,58.26 B14.P$5
  Bottom 0.203: v12.54,64.93 11.27,64.93 IC1.3 | v32.23,53.02 33.02,53.02 37.47,57.47 37.47,58.26 B14.P$5
GPA11  (via drill 0.41)
  Top 0.203: B13ALT.P$5 B13ALT1.P$5 69.37,58.26 v64.61,63.02 | v14.13,64.29 17.94,60.48 20,60.48 22.23,58.26 B13.P$5 | v41.91,64.29 41.27,63.66 v22.7,63.66
  Bottom 0.203: v14.13,64.29 11.27,64.29 IC1.4 | v64.61,63.02 63.98,63.02 63.34,63.66 58.26,63.66 56.36,65.56 50.64,65.56 49.37,64.29 v41.91,64.29 | v22.7,63.66 20.8,63.66 17.62,60.48 17.3,60.48 16.83,60.01 16.83,59.05 17.62,58.26 B13.P$5
GPA12  (via drill 0.41)
  Top 0.203: v23.02,70.33 23.02,71.28 24.45,72.71 36.99,72.71 37.62,72.07 56.2,72.07 63.02,78.9 64.29,78.9 66.52,81.12 B9ALT.P$5 B9.P$5 | B9ALT2.P$5 174.62,36.67 174.62,37.46 170.02,42.07 167.16,42.07 164.94,44.29 164.88,44.3 164.88,66.42 v143.88,87.42
  Bottom 0.203: v23.02,70.33 22.7,70.33 19.21,66.83 18.57,66.83 15.4,63.66 11.27,63.66 IC1.5 | B9.P$5 78.9,81.12 86.52,88.74 86.5,88.8 131.25,88.8 132.62,87.42 v143.88,87.42
GPA13  (via drill 0.41)
  Top 0.203: v8.73,62.07 9.05,62.07 22.38,48.73 v22.38,48.42 | v28.1,48.42 28.1,48.1 31.91,44.29 31.91,42.7 32.54,42.07 35.08,42.07 41.91,35.24 42.55,35.24 50.96,26.83 52.23,26.83 52.7,26.35 67.31,26.35 71.28,22.38 72.55,22.38 77.63,17.3 80.96,17.3 83.19,15.08 B10.P$5 83.98,15.08 86.2,12.86 86.2,12.54 88.42,10.32 89.06,10.32 90.81,12.06 90.81,15.08 B10ALT.P$5
  Bottom 0.203: v8.73,62.07 9.68,63.02 11.11,63.02 IC1.6 | v28.1,48.42 v22.38,48.42
GPA14  (via drill 0.41)
  Top 0.203: v12.54,63.02 12.54,62.7 25.88,49.37 30.64,49.37 33.18,46.83 33.18,46.51 40.8,38.89 41.12,38.89 41.91,38.1 41.91,37.78 52.86,26.83 97.31,26.83 101.76,22.38 102.08,22.38 106.05,18.41 106.05,15.08 | 106.05,15.08 B11.P$5 | 106.05,15.08 B11ALT.P$5
  Bottom 0.203: v12.54,63.02 12.06,62.55 11.27,62.55 IC1.7
GPA15  (via drill 0.41)
  Top 0.203: v8.41,61.12 9.05,61.12 v13.81,56.35 | v26.04,56.83 27.3,56.83 28.1,56.04 31.91,56.04 33.81,54.13 43.97,54.13 44.13,53.97 v46.67,53.97 | v48.42,58.1 58.1,58.1 63.66,63.66 68.74,63.66 72.39,67.31 74.93,67.31 77.47,69.85 82.55,69.85 86.2,73.5 B12ALT.P$5 B12.P$5
  Bottom 0.203: v8.41,61.12 8.73,61.12 9.37,61.75 11.11,61.75 IC1.8 | v13.81,56.35 23.34,56.35 23.81,56.83 v26.04,56.83 | v46.67,53.97 48.42,55.72 v48.42,58.1
GPA16  (via drill 0.41)
  Top 0.203: v104.46,47.94 v108.27,51.75 | v104.46,45.08 104.46,42.86 102.87,41.27 102.23,41.27 101.92,41.59 101.28,41.59 93.82,34.13 93.82,33.81 90.49,30.48 49.85,30.48 48.1,32.22 48.1,34.45 45.88,36.67 B24ALT.P$5 | v45.24,27.46 44.61,27.46 37.62,34.45 37.62,36.67 B24.P$5
  Bottom 0.203: v108.27,51.75 108.11,51.91 108.11,56.51 IC7.21 | v104.46,45.08 v104.46,47.94 | v45.24,27.46 45.24,36.67 B24ALT.P$5
GPA17  (via drill 0.41)
  Top 0.203: v108.74,54.45 101.44,47.15 101.44,45.88 99.38,43.81 99.38,40.64 93.98,35.24 83.19,35.24 79.06,31.11 v50.16,31.11 | v45.88,26.83 43.02,26.83 33.18,36.67 B23ALT.P$5 B23.P$5
  Bottom 0.203: v108.74,54.45 108.74,56.51 IC7.22 | v45.88,26.83 v50.16,31.11
GPA18  (via drill 0.41)
  Top 0.203: v120.81,59.53 124.94,59.53 136.05,48.42 149.07,48.42 153.83,43.65 153.83,40.16 155.1,38.89 155.89,38.89 159.54,35.24 165.1,35.24 185.26,15.08 B22.P$5
  Bottom 0.203: v120.81,59.53 111.6,59.53 109.54,57.47 109.54,56.67 IC7.23
GPA19  (via drill 0.41)
  Top 0.203: v118.59,58.26 122.4,58.26 132.24,48.42 132.24,45.56 v134.62,43.18 | 156.25,35.24 157.48,35.24 168.91,23.81 174.94,23.81 176.05,22.7 176.05,16.35 174.78,15.08 B21.P$5 | 156.25,35.24 156.21,35.24 | 156.25,35.24 156.25,35.3 151.75,39.8 151.75,41.05 151.62,41.17 v151.61,41.27
  Bottom 0.203: v118.59,58.26 111.12,58.26 110.17,57.31 110.17,56.67 IC7.24 | v134.62,43.18 136.21,41.59 151.29,41.59 v151.61,41.27
GPA20  (via drill 0.41)
  Top 0.203: v110.81,54.93 110.81,47.94 112.71,46.04 112.71,16.03 113.67,15.08 B17.P$5 B17ALT.P$5
  Bottom 0.203: v110.81,54.93 110.81,56.51 IC7.25
GPA21  (via drill 0.41)
  Top 0.203: v112.08,53.97 112.71,53.97 117.63,49.05 v122.4,49.05 | v124.62,44.29 127.16,41.75 127.16,37.3 127.95,36.51 127.95,35.88 v128.11,35.72 | v128.11,29.84 128.11,23.34 127.95,23.18 127.95,21.43 128.91,20.48 128.91,15.08 B18.P$5 B18ALT.P$5
  Bottom 0.203: v112.08,53.97 111.44,54.61 111.44,56.51 IC7.26 | v122.4,49.05 124.62,46.83 v124.62,44.29 | v128.11,29.84 v128.11,35.72
GPA22  (via drill 0.41)
  Top 0.203: v112.08,54.93 111.44,54.29 111.44,49.53 117,43.97 118.27,43.97 123.51,38.73 123.51,37.46 125.73,35.24 127,35.24 139.86,22.38 140.18,22.38 144.15,18.41 144.15,15.08 B19.P$5 B19ALT.P$5
  Bottom 0.203: v112.08,54.93 112.08,56.51 IC7.27
GPA23  (via drill 0.41)
  Top 0.203: v113.82,50.96 113.82,50 117,46.83 117,45.88 123.98,38.89 124.94,38.89 127.48,36.35 127.48,35.4 136.53,26.35 141.29,26.35 143.19,24.45 143.19,22.22 144.94,20.48 150.81,20.48 153.99,17.3 153.99,15.87 154.78,15.08 B20.P$5 B20ALT.P$5
  Bottom 0.203: v113.82,50.96 113.98,51.12 113.98,54.61 112.71,55.88 112.71,56.51 IC7.28
GPA24  (via drill 0.41)
  Top 0.203: v119.22,58.89 121.13,60.8 124.3,60.8 136.21,48.89 150.18,48.89 155.1,43.97 155.42,43.97 159.38,40 159.38,36.67 B32.P$5 B32ALT.P$5
  Bottom 0.203: v119.22,58.89 119.22,55.4 113.19,49.37 112.71,49.37 IC7.1
GPA25  (via drill 0.41)
  Top 0.203: v116.84,47.94 126.36,47.94 127.32,48.89 127.95,48.89 129.7,47.15 129.7,46.51 132.24,43.97 132.56,43.97 134.62,41.91 134.62,38.42 135.41,37.62 138.59,37.62 139.54,36.67 B31.P$5 B31ALT.P$5
  Bottom 0.203: v116.84,47.94 112.71,47.94 112.08,48.58 112.08,49.21 IC7.2
GPA26  (via drill 0.41)
  Top 0.203: v112.87,51.59 114.14,51.59 117.32,48.42 125.25,48.42 v125.41,48.58 | v127.64,46.35 127.64,37.94 128.91,36.67 B30.P$5 B30ALT.P$5
  Bottom 0.203: v112.87,51.59 111.44,50.16 111.44,49.37 IC7.3 | v127.64,46.35 v125.41,48.58
GPA27  (via drill 0.41)
  Top 0.203: v113.67,45.56 113.82,45.56 114.78,44.61 114.78,37.62 113.82,36.67 | 113.82,36.67 B29ALT.P$5 | 113.82,36.67 B29.P$5
  Bottom 0.203: v113.67,45.56 110.81,48.42 110.81,49.21 IC7.4
GPA28  (via drill 0.41)
  Top 0.203: v110.01,50.64 109.7,50.64 106.68,47.62 105.73,47.62 102.55,44.45 v102.55,41.91 | v98.74,41.91 98.74,40.64 93.82,35.72 83.03,35.72 80.33,33.02 61.91,33.02 60.48,34.45 60.48,36.67 B25ALT.P$5 B25.P$5
  Bottom 0.203: v110.01,50.64 110.01,49.37 IC7.5 | v98.74,41.91 v102.55,41.91
GPA29  (via drill 0.41)
  Top 0.203: v109.38,53.81 109.38,54.77 109.06,55.08 104.93,55.08 95.57,45.72 87,45.72 79.69,38.42 79.69,37.46 78.9,36.67 B26ALT.P$5 B26.P$5
  Bottom 0.203: v109.38,53.81 109.38,49.37 IC7.6
GPA30  (via drill 0.41)
  Top 0.203: v108.74,50.64 108.11,50.64 101.44,43.97 100.49,43.97 v100.01,43.5 | v98.74,42.86 96.84,40.96 96.84,39.37 94.14,36.67 B27ALT.P$5 B27.P$5
  Bottom 0.203: v108.74,50.64 108.74,49.37 IC7.7 | v100.01,43.5 99.38,43.5 v98.74,42.86
GPA31  (via drill 0.41)
  Top 0.203: v109.06,45.08 109.06,44.29 107.47,42.7 107.47,37.94 106.2,36.67 B28ALT.P$5 B28.P$5
  Bottom 0.203: v109.06,45.08 109.06,47.15 108.27,47.94 108.27,49.21 IC7.8
GPB4  (via drill 0.41)
  Top 0.203: 25.08,75.25 25.56,75.25 SSW1.8 | v20.62,85.67 24,85.67 24.75,86.42 28.62,86.42 29.5,85.55 v29.5,82.05
  Bottom 0.203: v20.62,85.67 18.75,83.8 18.75,83.3 U$17.19 | v29.5,82.05 29.5,75.92 28.25,74.67 26.25,74.67 25.75,75.17 SSW1.8
I2C_SCL  (via drill 0.41)
  Top 0.203: 134.3,56.51 134.25,56.51 | 134.25,56.51 v129.54,56.51 129.22,56.51 124.14,61.59 v121.6,61.59 | v68.42,52.07 86.36,52.07 87.47,50.96 98.27,50.96 v99.22,51.91 | v103.5,58.89 v103.5,61.75 | v7.46,22.54 21.43,8.57 v83.66,8.57 v86.2,11.11 | 2.38,39.37 v2.38,33.97 | 3.49,42.86 v3.49,43.18 v3.49,54.29 1.91,55.88 v1.91,58.42 | v106.05,46.99 106.36,46.99 107.63,45.72 109.38,45.72 112.08,43.02 112.08,34.29 105.89,28.1 v90.33,28.1 | v88.74,26.19 88.74,22.07 87.47,20.8 v87.47,13.81 | v12.54,49.37 v8.1,53.81 | v12.54,45.24 12.54,44.92 11.27,43.65 v11.27,42.38 | v8.57,35.4 8.57,34.29 8.26,33.97 v8.26,27.78 | v9.21,26.83 8.89,26.83 v6.19,24.13 | v155.88,72.05 150.62,72.05 150.19,72.49 | 150.19,72.49 146.88,75.8 SERIAL.4 | 150.19,72.49 134.25,56.55 134.25,56.51
  Bottom 0.203: v129.54,56.51 129.54,57.47 IC8.26 | v68.42,52.07 67.79,52.7 67.79,53.34 67.94,53.5 67.94,53.97 IC3.26 | 103.5,51.91 103.66,51.91 105.41,50.16 105.41,49.37 IC7.12 105.57,49.21 105.57,47.46 v106.05,46.99 | 103.5,51.91 v99.22,51.91 | v121.6,61.59 121.6,63.34 118.43,66.52 108.27,66.52 v103.5,61.75 | 103.5,51.91 v103.5,58.89 | v83.66,8.57 84.61,8.57 IC6.26 | v7.46,22.54 7.46,22.86 v6.19,24.13 6.12,24.18 6.12,24.55 4.75,25.93 3.5,25.93 2.38,27.05 2.38,33.92 v2.38,33.97 | IC2.26 2.38,43.18 v3.49,43.18 | v3.49,54.29 5.56,56.35 | 5.56,56.35 8.26,59.05 11.11,59.05 IC1.12 | v1.91,58.42 0.64,59.69 0.64,68.42 3.97,71.75 3.97,73.02 4,73.05 4,78.67 12.38,87.05 13.12,87.05 U$17.28 | v90.33,28.1 90.33,27.78 v88.74,26.19 | v87.47,13.81 86.2,12.54 v86.2,11.11 | v8.1,53.81 5.56,56.35 | v12.54,45.24 v12.54,49.37 | v11.27,42.38 11.27,37.46 11.43,37.3 11.43,36.67 10.16,35.4 v8.57,35.4 | v9.21,26.83 v8.26,27.78 | v155.88,72.05 155.88,71.05 U$94.P$4
I2C_SDA  (via drill 0.41)
  Top 0.203: v4.13,47.94 v4.13,43.81 4.76,43.18 5.71,43.18 6.03,43.5 6.03,58.89 5.08,59.85 5.08,62.07 | 5.08,62.07 5.08,68.74 5.12,68.8 5.12,69.67 v5.75,70.3 | 135.57,58.74 v130.02,58.74 130,58.8 v130,69.05 | v89.22,11.43 89.22,25.4 v89.53,25.72 | v106.84,39.69 106.84,42.07 105.09,43.81 v105.09,46.04 | 70.96,53.02 87.95,53.02 89.06,51.91 v98.27,51.91 | 70.96,53.02 v68.42,53.02 | v108.27,69.05 108.27,67.47 v101.44,60.64 | 5.08,62.07 6.51,62.07 19.37,49.21 v20.95,49.21 | v31.27,49.69 35.88,49.69 36.67,48.89 v53.66,48.89 | v59.05,50.8 63.82,50.8 64.29,51.27 v66.83,51.27 | 70.96,53.02 v70.96,52.7
  Bottom 0.203: v4.13,43.81 2.38,43.81 IC2.27 | v4.13,47.94 10.16,53.97 10.16,58.1 10.48,58.42 11.11,58.42 IC1.13 | v130.02,58.74 130.02,57.62 IC8.27 | v89.22,11.43 87,9.21 84.77,9.21 IC6.27 | v89.53,25.72 89.53,26.35 98.58,35.4 106.2,35.4 107.16,36.35 107.16,39.37 v106.84,39.69 | v105.09,46.04 105.09,48.42 104.93,48.58 104.93,49.21 IC7.13 104.78,49.37 104.78,50.16 104.62,50.32 99.85,50.32 v98.27,51.91 101.44,55.08 v101.44,60.64 | v68.42,53.02 68.58,53.18 68.58,53.97 IC3.27 | v108.27,69.05 v130,69.05 | v130,69.05 130.33,69.05 137.16,75.88 137.25,75.92 144.25,75.92 SERIAL.3 144.38,75.8 145.5,74.67 147.25,74.67 151.75,70.17 155.25,70.17 155.5,70.42 155.5,70.92 U$94.P$3 | v20.95,49.21 30.8,49.21 v31.27,49.69 | v53.66,48.89 57.15,48.89 v59.05,50.8 | v66.83,51.27 67.31,51.27 67.94,50.64 68.9,50.64 v70.96,52.7 | v130,69.05 | v5.75,70.3 5.75,79.8 12.12,86.17 13.12,86.17 U$17.27
L0
  Top 0.203: B1.P$2 B1ALT.P$2
  Bottom 0.203: B1.P$2 R20.1
L1
  Top 0.203: B1.P$3 B1ALT.P$3
  Bottom 0.203: B1.P$3 R19.1
L2
  Top 0.203: B2.P$2 B2ALT.P$2
  Bottom 0.203: B2.P$2 32.86,21.27 31.59,21.27 R18.1
L3
  Top 0.203: B2.P$3 B2ALT.P$3
  Bottom 0.203: B2.P$3 32.86,16.51 31.59,16.51 R17.1
L4
  Bottom 0.203: R16.1 46.83,21.27 48.1,21.27 B3.P$2 B3ALT.P$2
L5
  Bottom 0.203: R15.1 46.83,16.51 48.1,16.51 B3.P$3 B3ALT.P$3
L6
  Bottom 0.203: B4ALT.P$2 70.96,21.27 69.69,21.27 R14.1 69.53,21.11 68.74,20.32 67.31,20.32 66.2,21.43 B4.P$2
L7
  Top 0.203: B4ALT.P$3 B4.P$3
  Bottom 0.203: B4ALT.P$3 70.96,16.51 69.69,16.51 R13.1
L8  (via drill 0.41)
  Top 0.203: B5ALT1.P$2 B5ALT.P$2 | 55.27,85.28 55.4,85.41 v96.04,85.41 | 55.27,85.28 55.24,85.25 | v14.62,80.17 13.75,79.3 12.75,79.3 12,80.05 12,82.8 14.12,84.92 14.12,88.55 15.38,89.8 39.5,89.8 42.75,86.55 54,86.55 55.27,85.28
  Bottom 0.203: B5ALT.P$2 v96.04,85.41 | R12.1 19.12,79.92 17.88,79.92 B5.P$2 17.75,79.92 16.62,79.92 16.38,80.17 v14.62,80.17
L9  (via drill 0.41)
  Top 0.203: B5.P$3 17.78,75.88 17.79,75.89 | 18.89,76.99 17.79,75.89 | v87.47,87.47 86.52,87.47 86.36,87.63 86.38,87.67 83.12,90.92 14.12,90.92 9.75,86.55 v9.75,82.3 | B5ALT.P$3 v95.57,80.8 | v15.75,77.92 17.79,75.89
  Bottom 0.203: B5.P$3 R11.1 | B5ALT1.P$3 B5ALT.P$3 | v87.47,87.47 94.14,80.8 v95.57,80.8 | v15.75,77.92 14.12,77.92 v9.75,82.3
L10  (via drill 0.41)
  Top 0.203: B6ALT1.P$2 117,79.85 | 117,79.85 112.08,84.77 95.73,84.77 95.57,84.93 59.21,84.93 59.05,84.77 59,84.8 58.88,84.67 v58.62,84.67 | 117,79.85 B6ALT.P$2
  Bottom 0.203: B6.P$2 33.12,79.92 33.25,80.05 34.38,80.05 R10.1 34.5,80.17 34.5,85.05 40.38,90.92 52.38,90.92 v58.62,84.67
L11  (via drill 0.41)
  Top 0.203: B6ALT1.P$3 B6ALT.P$3 115.73,75.88 115.73,80.48 113.98,82.23 64.45,82.23 58.42,76.2 v57.78,76.2 | v42.86,74.77 B6.P$3
  Bottom 0.203: B6.P$3 33.18,74.61 34.45,74.61 R9.1 | v42.86,74.77 46.83,74.77 48.26,76.2 v57.78,76.2
L12  (via drill 0.41)
  Top 0.203: B7.P$2 54.45,74.77 55.88,76.2 56.2,76.2 v63.5,83.5 | v66.2,86.52 86.2,86.52 86.36,86.36 95.41,86.36 95.57,86.52 125.57,86.52 132.08,80.01 B7ALT.P$2
  Bottom 0.203: B7.P$2 48.42,74.93 49.69,74.93 R8.1 | 137.16,79.85 B7ALT.P$2 132,79.92 128.75,79.92 128,80.67 128,81.55 128.62,82.17 153.75,82.17 166.12,69.8 166.12,51.42 174.5,43.05 185.38,43.05 B7ALT1.P$2 | v63.5,83.5 63.5,83.82 v66.2,86.52
L13  (via drill 0.41)
  Top 0.203: B7ALT1.P$3 184.31,39.05 184.31,43.02 184.25,43.05 177.38,43.05 v165.5,54.92 | v63.18,86.04 65.72,86.04 65.88,85.88 95.57,85.88 95.73,86.04 125.41,86.04 130.97,80.48 130.97,75.88 B7ALT.P$3 133.19,74.77 138.43,69.53 138.5,69.55 138.62,69.42 v143.38,69.42 | B7.P$3 48.38,79.92 54.38,79.92 v54.45,79.85
  Bottom 0.203: 49.69,79.69 R7.1 49.62,79.67 48.5,79.67 48.38,79.8 B7.P$3 | v54.45,79.85 57.15,82.55 59.69,82.55 v63.18,86.04 | v165.5,54.92 157.88,54.92 v143.38,69.42
L14
  Bottom 0.203: B8ALT.P$2 56.04,74.93 57.31,74.93 R6.1 57.47,74.93 58.42,75.88 59.69,75.88 60.8,74.77 B8.P$2
L15
  Bottom 0.203: B8ALT.P$3 56.04,79.69 57.31,79.69 R5.1 57.47,79.53 58.26,78.74 59.69,78.74 60.8,79.85 B8.P$3
L16  (via drill 0.41)
  Top 0.203: B9ALT2.P$2 166.85,43.02 165.58,44.29 v165.58,45.08
  Bottom 0.203: B9ALT.P$2 71.28,74.93 72.55,74.93 R32.1 72.71,75.09 73.5,75.88 75.09,75.88 76.2,74.77 B9.P$2 80.01,76.04 86.52,76.04 90.01,72.55 102.71,72.55 106.84,68.42 108.58,68.42 108.74,68.58 118.43,68.58 122.71,64.29 122.71,63.34 124.46,61.59 124.5,61.55 130.75,61.55 134.88,57.42 137.75,57.42 138.38,56.8 148.38,56.8 160,45.17 160.02,45.08 v165.58,45.08
L17  (via drill 0.41)
  Top 0.203: B9ALT.P$3 B9.P$3 | B9ALT2.P$3 170.18,38.42 162.4,46.2 162.38,46.17 162.38,68.05 v142.38,88.05 | v86.84,88.11 139.06,88.11 v139.12,88.05
  Bottom 0.203: B9ALT.P$3 71.28,79.69 72.55,79.69 R31.1 | v86.84,88.11 78.74,80.01 B9.P$3 | v139.12,88.05 v142.38,88.05
L18
  Bottom 0.203: R30.1 77.31,21.27 78.58,21.27 B10.P$2 B10ALT.P$2
L19
  Bottom 0.203: R29.1 77.31,16.51 78.58,16.51 B10.P$3 B10ALT.P$3
L20
  Top 0.203: B11.P$2 B11ALT.P$2
  Bottom 0.203: B11.P$2 93.82,21.27 92.55,21.27 R28.1
L21
  Bottom 0.203: R27.1 92.55,16.51 93.82,16.51 B11.P$3 B11ALT.P$3
L22
  Top 0.203: B12ALT.P$2 B12.P$2
  Bottom 0.203: B12ALT.P$2 R57.1
L23
  Top 0.203: B12ALT.P$3 B12.P$3
  Bottom 0.203: B12ALT.P$3 R56.1
L24  (via drill 0.41)
  Top 0.203: B13ALT.P$2 B13ALT1.P$2 | v50.16,67.31 v22.07,67.31
  Bottom 0.203: B13.P$2 R63.1 19.37,64.61 v22.07,67.31 | v50.16,67.31 65.09,67.31 67.79,64.61 B13ALT1.P$2
L25  (via drill 0.41)
  Top 0.203: B13ALT.P$3 B13ALT1.P$3 68.9,59.53 68.26,60.16 68.26,60.32 v67.94,60.64 | B13.P$3 18.89,59.53 v24.77,53.66 | v59.53,60.48 v46.04,60.48
  Bottom 0.203: B13.P$3 R62.1 | v24.77,53.66 30.16,53.66 31.43,54.93 31.43,59.37 33.02,60.96 38.1,60.96 40.32,63.18 41.91,63.18 44.61,60.48 v46.04,60.48 | v59.53,60.48 67.79,60.48 v67.94,60.64
L26
  Top 0.203: B14.P$2 B14ALT.P$2
  Bottom 0.203: B14.P$2 R61.1
L27
  Top 0.203: B14.P$3 B14ALT.P$3
  Bottom 0.203: B14.P$3 R60.1
L28
  Top 0.203: B15ALT.P$2 B15.P$2
  Bottom 0.203: B15ALT.P$2 R59.1
L29
  Bottom 0.203: R58.1 B15ALT.P$3 B15.P$3
L30
  Top 0.203: B16ALT.P$2 B16.P$2
  Bottom 0.203: B16ALT.P$2 86.2,64.45 84.93,64.45 R65.1
L31
  Top 0.203: B16ALT.P$3 B16.P$3
  Bottom 0.203: B16ALT.P$3 86.2,59.69 84.93,59.69 R64.1
L32
  Bottom 0.203: B17ALT.P$2 116.68,21.27 115.41,21.27 R39.1 115.25,21.11 114.3,20.16 111.76,20.16 110.49,21.43 B17.P$2
L33
  Bottom 0.203: B17ALT.P$3 116.68,16.51 115.41,16.51 R38.1 115.25,16.67 114.46,17.46 113.03,17.46 111.92,16.35 B17.P$3
L34
  Bottom 0.203: B18ALT.P$2 131.92,21.27 130.65,21.27 R37.1 130.49,21.11 129.38,20 127.48,20 126.05,21.43 B18.P$2
L35
  Bottom 0.203: B18ALT.P$3 131.92,16.51 130.65,16.51 R36.1 130.49,16.67 129.7,17.46 128.27,17.46 127.16,16.35 B18.P$3
L36
  Bottom 0.203: R35.1 138.27,21.27 139.54,21.27 B19.P$2 B19ALT.P$2
L37
  Bottom 0.203: R34.1 138.27,16.51 139.54,16.51 B19.P$3 B19ALT.P$3
L38
  Top 0.203: B20.P$2 B20ALT.P$2
  Bottom 0.203: B20.P$2 154.78,21.27 153.51,21.27 R26.1
L39
  Top 0.203: B20.P$3 B20ALT.P$3
  Bottom 0.203: B20.P$3 154.78,16.51 153.51,16.51 R25.1
L40
  Bottom 0.203: B21.P$2 170.02,21.27 168.75,21.27 R24.1
L41
  Bottom 0.203: B21.P$3 170.02,16.51 168.75,16.51 R23.1
L42
  Bottom 0.203: B22.P$2 R22.1
L43
  Bottom 0.203: B22.P$3 R21.1
L44
  Top 0.203: B23ALT.P$2 B23.P$2
  Bottom 0.203: B23ALT.P$2 R4.1
L45
  Bottom 0.203: R3.1 B23ALT.P$3 B23.P$3
L46
  Bottom 0.203: B24ALT.P$2 40.48,42.86 39.21,42.86 R2.1 39.05,42.86 38.1,41.91 36.83,41.91 35.72,43.02 B24.P$2
L47
  Bottom 0.203: B24ALT.P$3 40.48,38.1 39.21,38.1 R1.1 39.05,38.26 38.26,39.05 36.83,39.05 35.72,37.94 B24.P$3
L48
  Top 0.203: B25ALT.P$2 B25.P$2
  Bottom 0.203: B25ALT.P$2 R55.1
L49
  Top 0.203: B25ALT.P$3 B25.P$3
  Bottom 0.203: B25ALT.P$3 R54.1
L50
  Top 0.203: B26ALT.P$2 B26.P$2
  Bottom 0.203: B26ALT.P$2 R53.1
L51
  Top 0.203: B26ALT.P$3 B26.P$3
  Bottom 0.203: B26ALT.P$3 R52.1
L52
  Bottom 0.203: R51.1 B27ALT.P$2 B27.P$2
L53
  Bottom 0.203: R50.1 B27ALT.P$3 B27.P$3
L54  (via drill 0.41)
  Top 0.203: v96.2,40.8 B28.P$2 | v104.14,41.27 v102.23,39.37
  Bottom 0.203: B28ALT.P$2 102.39,43.02 | 102.39,43.02 R49.1 | v96.2,40.8 97.79,40.8 99.22,39.37 v102.23,39.37 | 102.39,43.02 v104.14,41.27
L55
  Bottom 0.203: R48.1 B28ALT.P$3 B28.P$3
L56
  Bottom 0.203: R47.1 B29ALT.P$2 B29.P$2
L57
  Bottom 0.203: R46.1 B29ALT.P$3 B29.P$3
L58
  Bottom 0.203: B30ALT.P$2 131.92,42.86 130.65,42.86 R45.1 130.49,42.7 129.7,41.91 128.27,41.91 127.16,43.02 B30.P$2
L59
  Bottom 0.203: B30ALT.P$3 131.92,38.1 130.65,38.1 R44.1 130.49,38.26 128.91,39.84 127.95,39.84 126.05,37.94 B30.P$3
L60
  Top 0.203: B31.P$2 B31ALT.P$2
  Bottom 0.203: B31.P$2 139.54,42.86 138.27,42.86 R43.1
L61
  Top 0.203: B31.P$3 B31ALT.P$3
  Bottom 0.203: B31.P$3 139.54,38.1 138.27,38.1 R42.1
L62
  Bottom 0.203: R41.1 153.51,42.86 154.78,42.86 B32.P$2 155,43.05 155.25,43.3 160,43.3 160.25,43.05 162.5,43.05 B32ALT.P$2
L63
  Bottom 0.203: R40.1 153.51,38.1 154.78,38.1 B32.P$3 B32ALT.P$3
MISO  (via drill 0.41)
  Top 0.203: v21.88,83.8 22.75,83.8 23.62,84.67 26.62,84.67 27.38,85.42 v27.88,85.42
  Bottom 0.203: v21.88,83.8 21.88,84.55 U$17.16 | v27.88,85.42 27.88,85.8 33.25,91.17 33.25,93.3 33,93.55 27.38,93.55 26.38,92.55 JP1.3
MOSI  (via drill 0.41)
  Top 0.203: 138.12,89.67 139.88,89.67 150.75,78.8 150.75,78.3 149.62,77.17 146.38,77.17 145.5,76.3 145.5,72.92 146.75,71.67 146.75,70.92 SERIAL.8 | 138.12,89.67 138.11,89.69 | v23.25,79.55 25.62,77.17 SSW1.6 | 138.12,89.67 v137.88,89.92